# EAGLE design FT231X-USBserial (EAGLE 7.7.0)
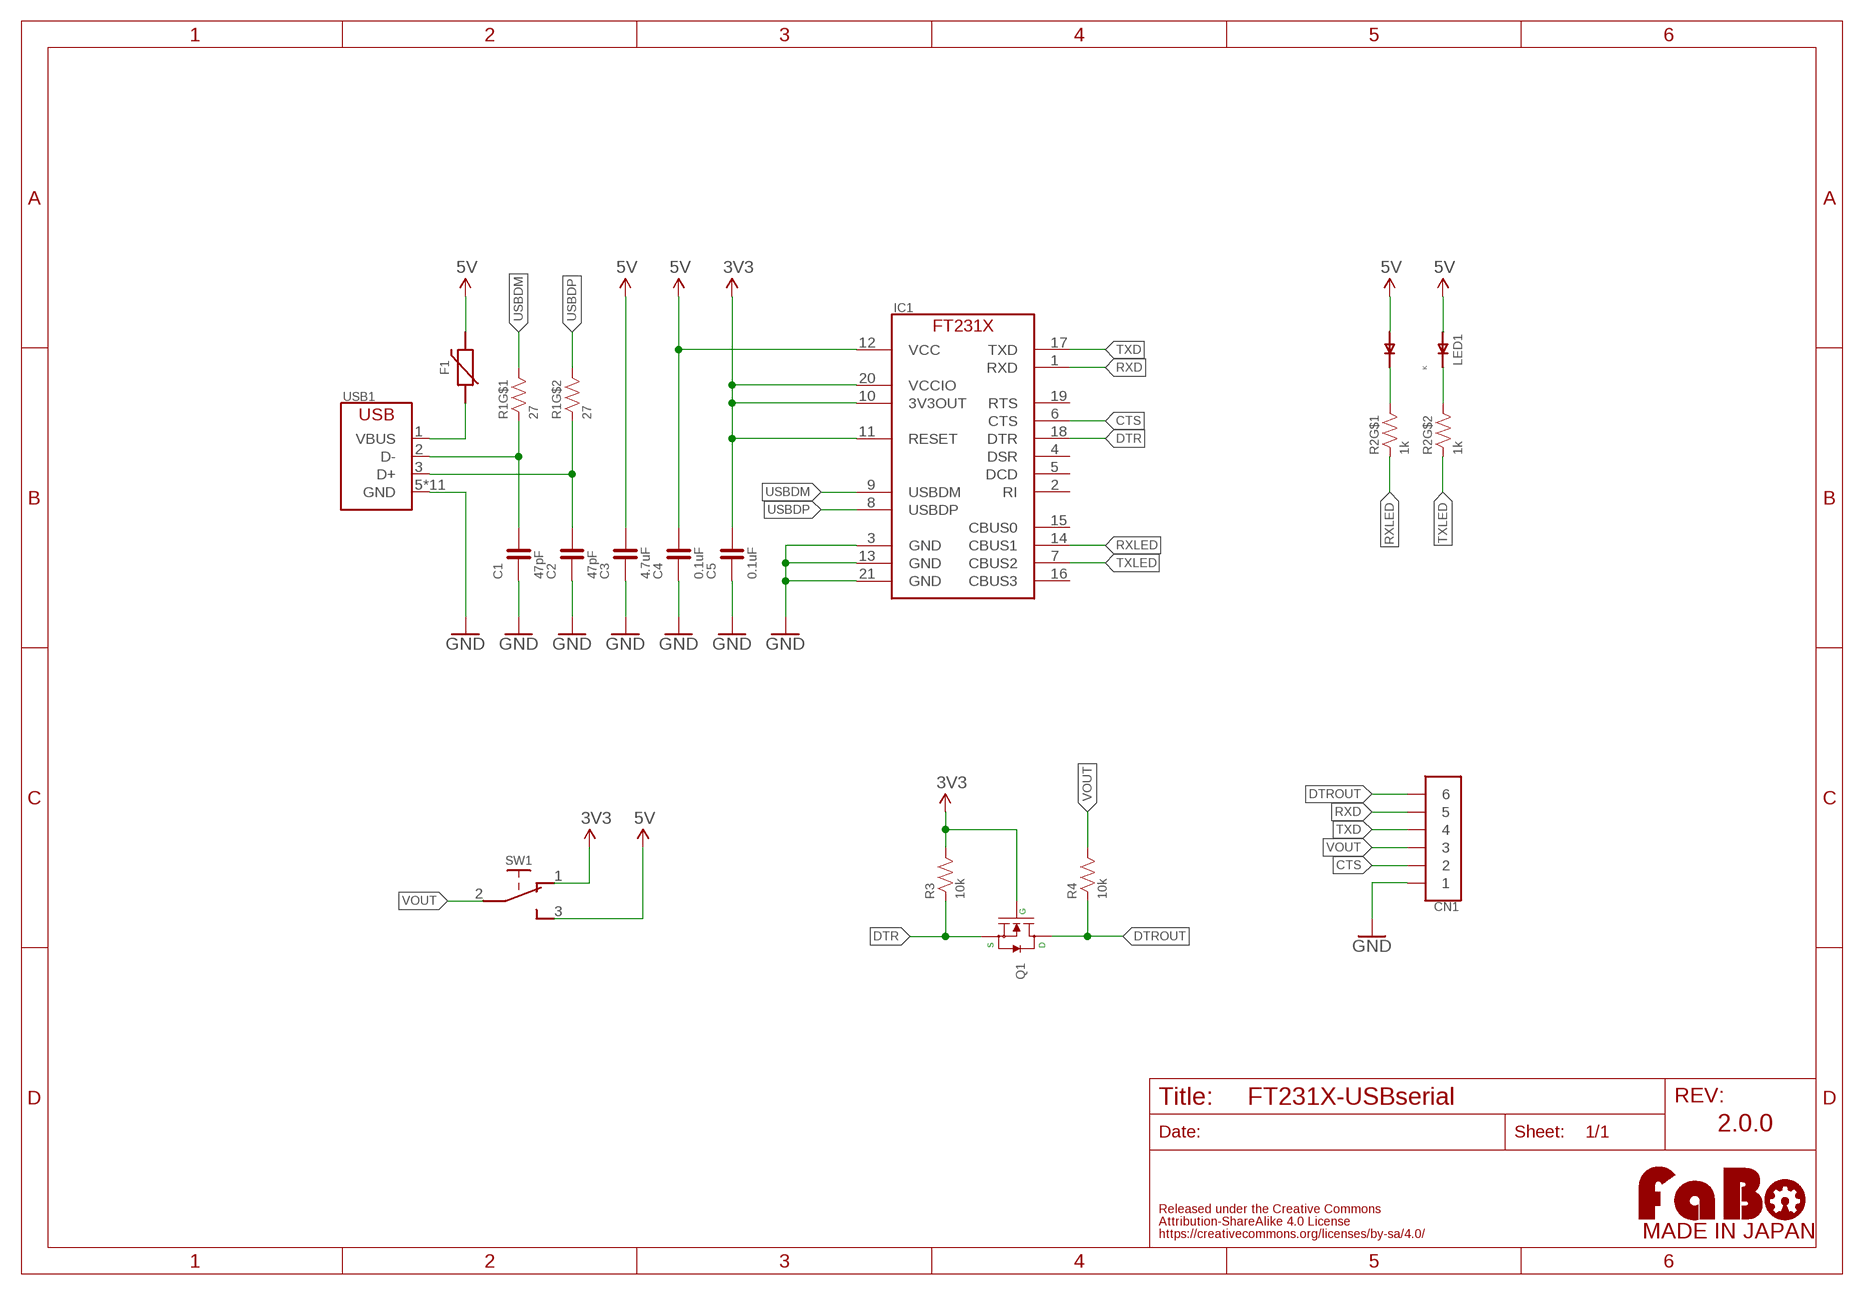
[diagram p0: schematic, sheet 1]

## Parts
C1  47pF  CAPACITOR-0603  [EIA0603]
C2  47pF  CAPACITOR-0603  [EIA0603]
C3  4.7uF  CAPACITOR-0603  [EIA0603]
C4  0.1uF  CAPACITOR-0603  [EIA0603]
C5  0.1uF  CAPACITOR-0603  [EIA0603]
CN1  PIN_1X6_NARROW  [PIN_1X6_NARROW]
F1  PPTC-NANO  [NANOSMDC035F]
IC1  FT231XQ  [QFN-20]
LED1  HSMF-C16X  [HSMF-C16X]
LOGO1  LOGO_FABO-M_BOTTOM  [LOGO_FABO_M_BOTTOM]
Q1  MOSFET-N  [SOT-23-3]
R1  27  RESISTOR_ARRAY_2  [EXBV4V]
R2  1k  RESISTOR_ARRAY_2  [EXBV4V]
R3  10k  RESISTOR-0603  [EIA0603]
R4  10k  RESISTOR-0603  [EIA0603]
SW1  SWITCH-SLIDE  [SSSS810701]
USB1  USB-ZX62D  [ZX62D-B-5PA8]

## Nets
3V3: C5.2 IC1.10(3V3OUT) IC1.11(RESET) IC1.20(VCCIO) Q1.1(G) R3.2 SW1.1
5V: C3.2 C4.2 F1.2 IC1.12(VCC) LED1.1(A1) LED1.2(A2) SW1.3
CTS: CN1.2 IC1.6(CTS)
DTR: IC1.18(DTR) Q1.2(S) R3.1
DTROUT: CN1.6 Q1.3(D) R4.1
GND: C1.1 C2.1 C3.1 C4.1 C5.1 CN1.1 IC1.3(GND) IC1.13(GND) IC1.21(GND) USB1.5(GND) USB1.B1(GND) USB1.B2(GND) USB1.B3(GND) USB1.B4(GND) USB1.T1(GND) USB1.T2(GND) USB1.T3(GND) USB1.T4(GND) USB1.T5(GND) USB1.T6(GND)
K_RXLED: LED1.4(K2) R2.4
K_TXLED: LED1.3(K1) R2.3
O_USBDM: C1.2 R1.1 USB1.2(D-)
O_USBDP: C2.2 R1.2 USB1.3(D+)
O_VBUS: F1.1 USB1.1(VBUS)
RXD: CN1.5 IC1.1(RXD)
RXLED: IC1.14(CBUS1) R2.1
TXD: CN1.4 IC1.17(TXD)
TXLED: IC1.7(CBUS2) R2.2
USBDM: IC1.9(USBDM) R1.4
USBDP: IC1.8(USBDP) R1.3
VOUT: CN1.3 R4.2 SW1.2
Unconnected: IC1.2(RI) IC1.4(DSR) IC1.5(DCD) IC1.15(CBUS0) IC1.16(CBUS3) IC1.19(RTS)

## Notes on the sheet
- 2.0.0

## Library data of the parts
C1-C5 = component:CAPACITOR
CN1 = component:PIN_1X6
F1 = component:PPTC
IC1 = component:FT231X
LED1 = component:HSMF-C16X
LOGO1 = component:LOGO_FABO
Q1 = component:MOSFET-N
R1 R2 = component:RESISTOR_ARRAY_2
R3 R4 = component:RESISTOR
SW1 = component:SWITCH-SLIDE
USB1 = component:USB

## Board
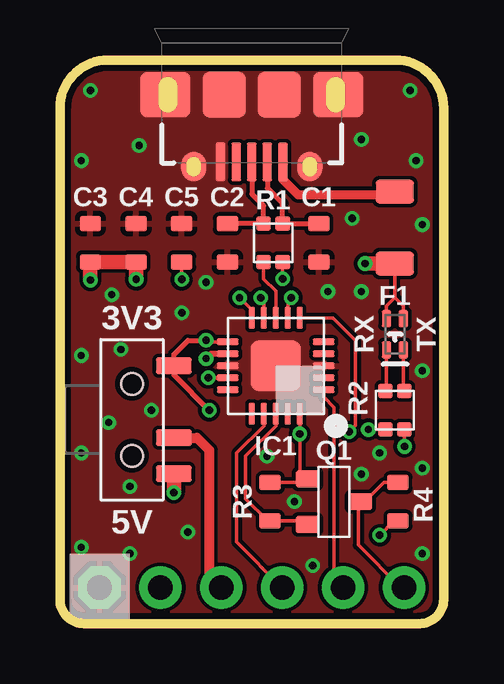
[diagram p1: board, top side]
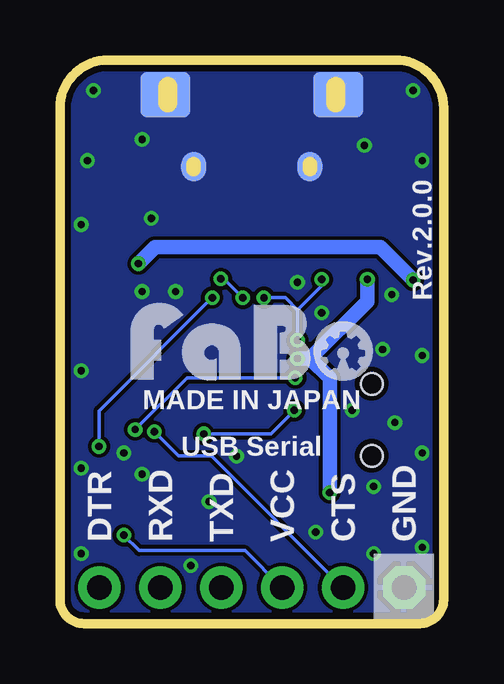
[diagram p2: board, bottom side, seen from below]

Size 16 x 23.5 mm. Coordinates in mm from the lower left corner, seen from the top.
Outline: 1,0 15,0 arc90 16,1 16,21.5 arc90 14,23.5 2,23.5 arc90 0,21.5 0,1 arc90 1,0
Copper layers (1*16): Top 0.035mm / dielectric 1.6mm / Bottom 0.035mm
Design rules "PCBway *": minimum track width 6mil, minimum drill 12mil, track to track 6mil, track to pad 6mil, pad to pad 6mil, via to via 6mil, smd to smd 6mil, copper to edge 10mil, drill to drill 10mil, minimum pad ring 10mil, minimum via ring 6mil, stop-mask expansion 2mil, vias tented up to drill 100mil, thermal gap 8mil

### Footprints (pad centres in the part's own frame; a part is rotated, then mirrored left to right if it is on the bottom)
EIA0603 = smd 0.65 x 0.9: 1 -0.8,0; 2 0.8,0
PIN_1X6_NARROW = drill 1.02 pad 1.778 octagon: 1 -6.35,0 | drill 1.02 pad 1.778: 2 -3.81,0; 3 -1.27,0; 4 1.27,0; 5 3.81,0; 6 6.35,0
NANOSMDC035F = smd 1 x 1.6: 1 -1.5,0; 2 1.5,0
QFN-20 = smd 0.9 x 0.25: 1 -2,1; 2 -2,0.5; 3 -2,0; 4 -2,-0.5; 5 -2,-1; 11 2,-1; 12 2,-0.5; 13 2,0; 14 2,0.5; 15 2,1 | smd 0.25 x 0.9: 6 -1,-2; 7 -0.5,-2; 8 0,-2; 9 0.5,-2; 10 1,-2; 16 1,2; 17 0.5,2; 18 0,2; 19 -0.5,2; 20 -1,2 | smd 2.1 x 2.1: 21 0,0
HSMF-C16X = smd 0.7 x 0.4: 1 -0.65,0.35; 2 -0.65,-0.35; 3 0.65,0.35; 4 0.65,-0.35
SOT-23-3 = smd 0.7 x 1: 1 -0.95,-1.1; 2 0.95,-1.1; 3 0,1.1
EXBV4V = smd 0.6 x 0.6: 1 -0.4,-0.8; 2 0.4,-0.8; 3 0.4,0.8; 4 -0.4,0.8
SSSS810701 = smd 0.7 x 1.5: 1 -2.25,1.75; 2 0.75,1.75; 3 2.25,1.75 | hole 0.9: -1.5,0; 1.5,0
ZX62D-B-5PA8 = smd 0.4 x 1.6: 1 -1.3,4.25; 2 -0.65,4.25; 3 0,4.25; 4 0.65,4.25; 5 1.3,4.25 | smd 1.05 x 1.25 bottom: B1 -2.425,4.45; B2 2.425,4.45 | smd 2.1 x 1.9 bottom: B3 -3.6,1.45; B4 3.6,1.45 | smd 1.05 x 1.25: T1 -2.425,4.45; T2 2.425,4.45 | smd 2.1 x 1.9: T3 -3.6,1.45; T6 3.6,1.45 | smd 1.8 x 1.9: T4 -1.15,1.45; T5 1.15,1.45

### Placement (x,y rotation side)
C1  10.79,15.88 90 top
C2  6.99,15.88 90 top
C3  1.27,15.88 270 top
C4  3.17,15.88 270 top
C5  5.08,15.88 270 top
CN1  8,1.5 0 top
F1  13.97,16.51 270 top
IC1  9,10.75 180 top
LED1  13.97,12.06 270 top
LOGO1  8,9.75 0 top
Q1  11.43,5.08 270 top
R1  8.89,15.88 180 top
R2  13.97,8.89 0 top
R3  8.76,5.08 90 top
R4  14.1,5.08 270 top
SW1  3,8.5 270 top
USB1  8,23.5 180 top

### Tracks (layer width: path | path; a pad name or v marks a point on that pad's centre or on a via)
3V3  (via drill 0.3)
  Top 0.152: IC1.10 8,13.08 v7.49,13.59 | C5.2 v5.08,14.35 | IC1.11 6.16,11.75 v6.1,11.81 | IC1.20 v10,7.91 10,6.36 Q1.1 10.18,5.88 R3.2
  Top 0.203: v6.22,8.89 4.75,10.36 SW1.1 4.75,11.23 5.33,11.81 v6.1,11.81
  Bottom 0.152: v5.08,14.35 5.08,14.1 6.1,13.08 | v6.1,11.81 6.1,13.08 | 6.1,13.08 6.6,13.59 v7.49,13.59 | v10,7.91 7.21,7.91 v6.22,8.89
5V  (via drill 0.3)
  Top 0.152: LED1.1 14.32,13.24 13.97,13.59 | 13.97,13.59 F1.2 | LED1.2 13.62,13.24 13.97,13.59
  Top 0.254: IC1.12 6.3,11.25 v6.1,11.05
  Top 0.61: v3.17,14.35 C4.2 C3.2 v1.27,14.33 | SW1.3 v4.75,5.46 | v12.72,15.01 F1.2
  Bottom 0.61: v6.1,11.05 5.56,11.05 | v4.75,5.46 4.75,10.24 5.56,11.05 | v3.17,14.35 3.17,13.44 5.56,11.05 | v12.72,15.01 12.04,15.7 2.64,15.7 v1.27,14.33
CTS  (via drill 0.3)
  Top 0.152: v12.06,8 12.32,8.26 12.32,11.81 11.38,12.75 IC1.6
  Bottom 0.152: CN1.2 9.68,6.99 11.05,6.99 v12.06,8
DTR
  Top 0.152: IC1.18 9,8.24 7.75,6.99 7.75,5.21 8.67,4.28 R3.1 10.18,4.28 Q1.2
DTROUT
  Top 0.152: R4.1 13.5,5.88 12.7,5.08 | Q1.3 12.7,5.08 | 12.7,5.08 12.45,4.83 12.45,3.28 14.22,1.5 CN1.6
GND  (via drill 0.3)
  other vias: 15.11,6.48 8.64,6.99 15.11,2.92 10.54,2.41 9.78,5.08 12.57,6.22 13.34,7.11 5.33,3.81 2.92,2.92 0.89,3.17 0.89,11.18 1.27,22.23 14.61,22.23 14.86,19.3 0.89,19.3 3.3,19.94 12.57,20.19 12.19,16.89 11.18,13.84 12.57,13.84 15.11,10.54 5.08,12.95 6.1,14.22 2.16,13.72 2.03,8.38 2.92,5.71 3.81,8.89 2.54,11.43 0.89,7.11 15.11,16.64
  pour Bottom (isolate 0.152, rank 3): 0,23.5 16,23.5 16,0 0,0
  pour Top (isolate 0.152, rank 3): 0,23.5 16,23.5 16,0 0,0
  pour Top (isolate 0.152, rank 2, no thermals): 7,12.75 11,12.75 11,8.75 7,8.75
  pour Top (isolate 0.152, rank 3, no thermals): 3,18 13,18 13,23.5 3,23.5
  pour Bottom (isolate 0.152, rank 3, no thermals): 3,18 13,18 13,23.5 3,23.5
K_RXLED
  Top 0.152: LED1.4 13.62,9.74 R2.4
K_TXLED
  Top 0.152: LED1.3 14.32,9.74 R2.3
O_USBDM
  Top 0.203: USB1.2 8.65,18.15 9.29,17.51 R1.1 C1.2
O_USBDP
  Top 0.203: USB1.3 8,17.91 8.49,17.42 R1.2 C2.2
O_VBUS
  Top 0.381: USB1.1 9.3,18.51 9.93,17.88 13.84,17.88 F1.1
RXD
  Top 0.152: CN1.5 11.43,1.88 11.43,9.02 11,9.45 IC1.1
RXLED  (via drill 0.3)
  Top 0.152: IC1.14 v6.19,10.25 | R2.1 v12.87,8.09
  Bottom 0.152: v12.87,8.09 10.71,10.25 v6.19,10.25
TXD
  Top 0.152: IC1.17 8.5,8.25 7.37,7.11 7.37,3.4 CN1.4
TXLED  (via drill 0.3)
  Top 0.152: IC1.7 9.5,13.44 v9.65,13.59 | R2.2 v14.37,7.38
  Bottom 0.152: v14.37,7.38 14.37,8.87 v9.65,13.59
USBDM  (via drill 0.3)
  Top 0.152: R1.4 v9.29,14.37 | IC1.9 8.5,13.45 v8.37,13.58
  Bottom 0.152: v9.29,14.37 9.16,14.37 v8.37,13.58
USBDP
  Top 0.152: R1.3 8.49,14.37 9,13.86 IC1.8
VOUT  (via drill 0.3)
  Top 0.152: R4.2 13.93,4.28 v13.34,3.68
  Top 0.406: SW1.2 5.71,7.75 6.22,7.24 6.22,2.01 CN1.3
  Bottom 0.152: CN1.3 8.28,3.05 12.7,3.05 v13.34,3.68

### Text on the board
tPlace: 3V3 | RX | TX | 5V
bPlace: Rev.2.0.0 | MADE IN JAPAN | USB Serial | GND | CTS | VCC | TXD | RXD | DTR
tDocu: productnumber here